# EAGLE design UVC Module (EAGLE 9.4.2)
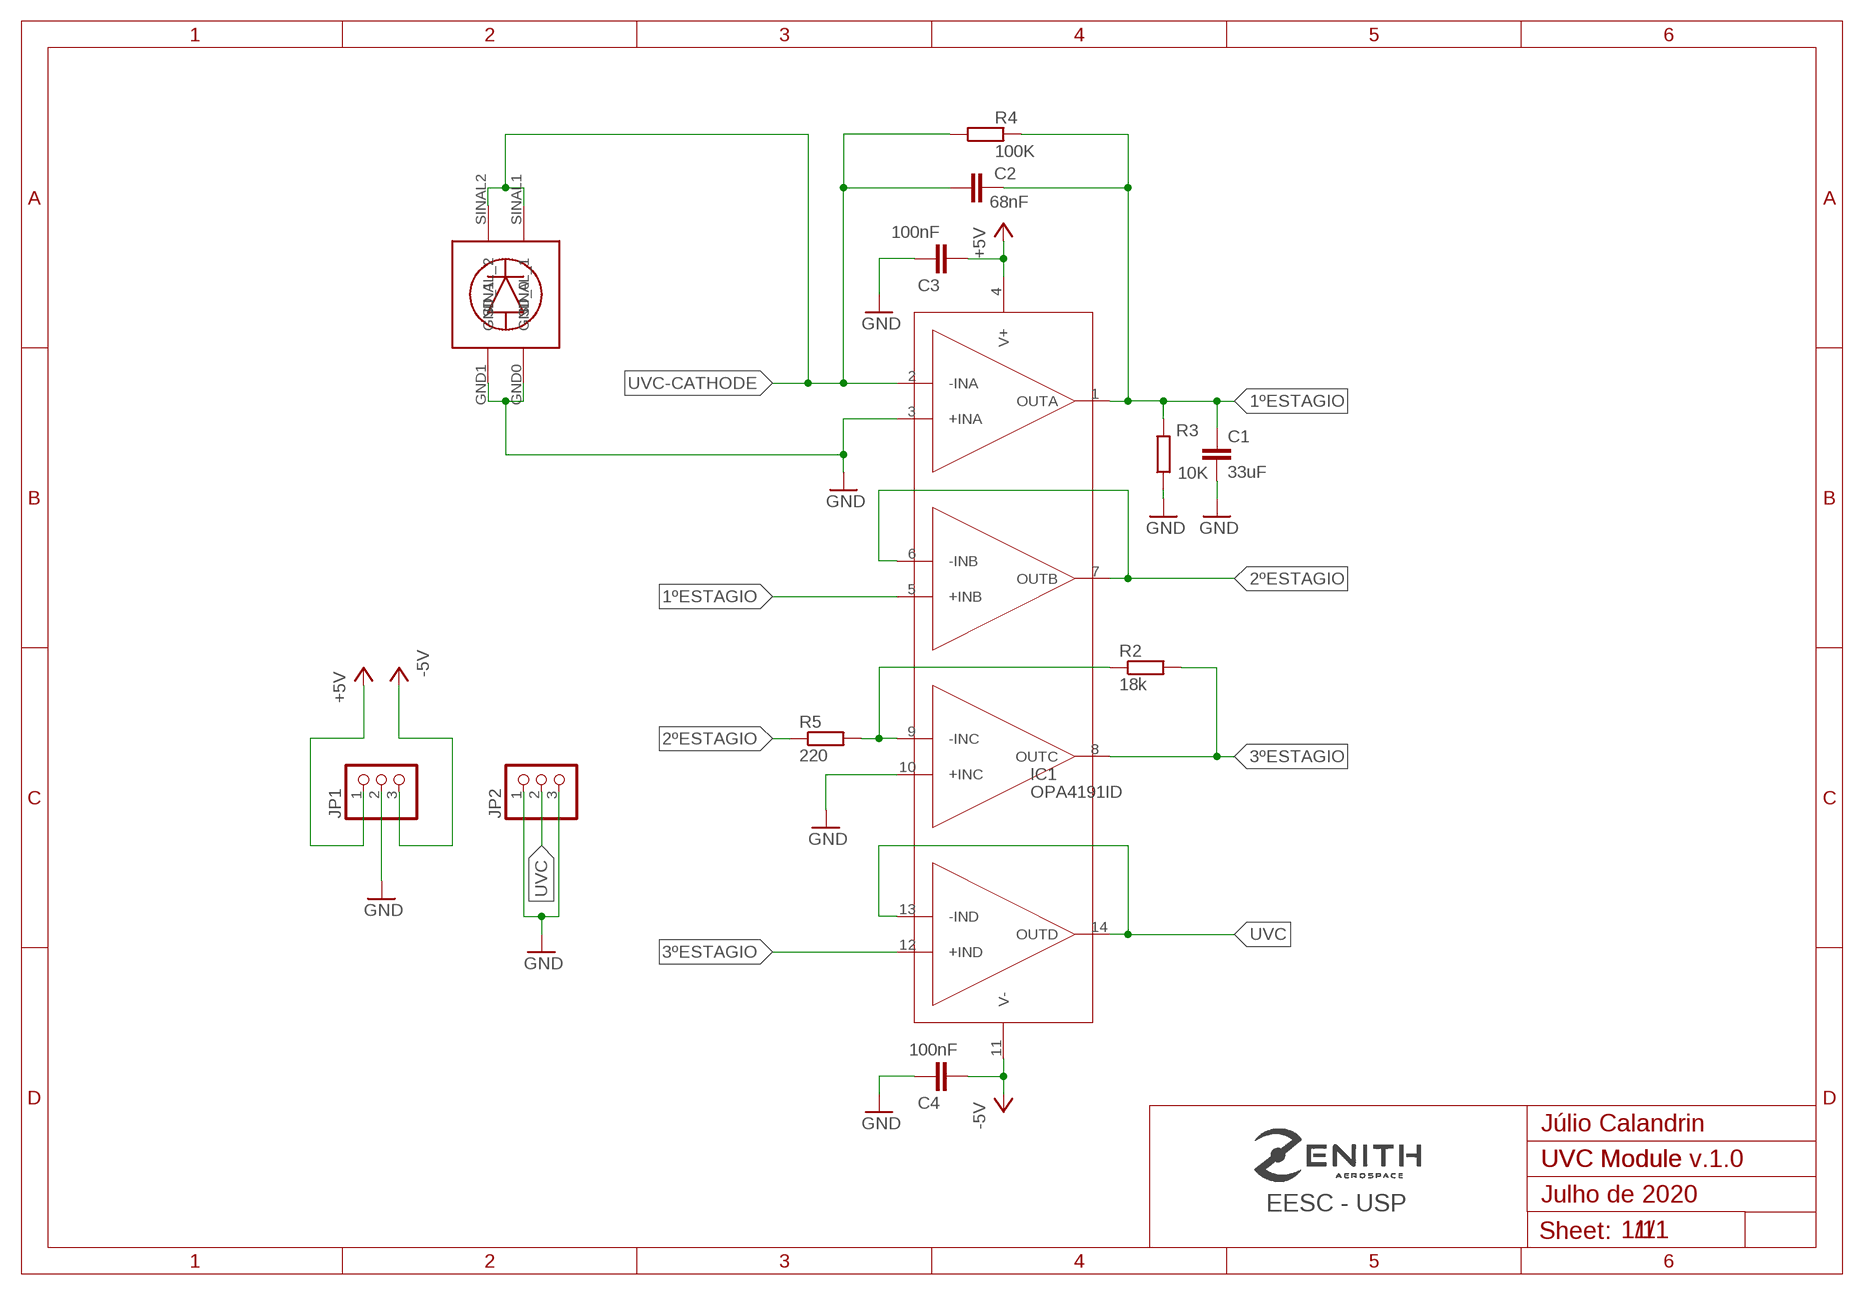
[diagram p0: schematic, sheet 1]

## Parts
C1  33uF  C-EUC0805  [C0805]
C2  68nF  C-EUC0805  [C0805]
C3  100nF  C-EUC0805  [C0805]
C4  100nF  C-EUC0805  [C0805]
IC1  OPA4191ID  [D14_TEX]
JP1  PINHD-1X3  [1X03]
JP2  PINHD-1X3  [1X03]
R2  18k  R-EU_R0805  [R0805]
R3  10K  R-EU_R0805  [R0805]
R4  100K  R-EU_R0805  [R0805]
R5  220  R-EU_R0805  [R0805]
U$1  BREAKOUT_UV-C  [PADS_UV-C]

## Nets
1ºESTAGIO: C1.1 C2.2 IC1.1(OUTA) IC1.5(+INB) R3.2 R4.2
2ºESTAGIO: IC1.6(-INB) IC1.7(OUTB) R5.1
3ºESTAGIO: IC1.8(OUTC) IC1.12(+IND) R2.2
+5V: C3.1 IC1.4(V+) JP1.1
-5V: C4.1 IC1.11(V-) JP1.3
GND: C1.2 C3.2 C4.2 IC1.3(+INA) IC1.10(+INC) JP1.2 JP2.1 JP2.3 R3.1 U$1.GND0(GND_0) U$1.GND1(GND_1)
N$1: IC1.9(-INC) R2.1 R5.2
UVC: IC1.13(-IND) IC1.14(OUTD) JP2.2
UVC-CATHODE: C2.1 IC1.2(-INA) R4.1 U$1.SINAL1(SINAL_1) U$1.SINAL2(SINAL_2)

## Notes on the sheet
- Júlio Calandrin
- UVC Module v.1.0
- EESC - USP | Julho de 2020
- 1/1

## Library data of the parts
C1-C4 = rcl:C-EU: CAPACITOR, European symbol; SPICEPREFIX: C
IC1 = OPA4191:OPA4191ID; BUILT_BY: EMA_Molly; COPYRIGHT: Copyright (C) 2018 Accelerated Designs. All rights reserved; MANUFACTURER_PART_NUMBER: OPA4191ID; SOURCELIBRARY: TI_2019-05-11; VENDOR: Texas Instruments
JP1 JP2 = pinhead(1x3):PINHD-1X3: PIN HEADER
R2-R5 = rcl:R-EU_: RESISTOR, European symbol; SPICEPREFIX: R
U$1 = Zenith_Breakouts:BREAKOUT_UV-C

## Board
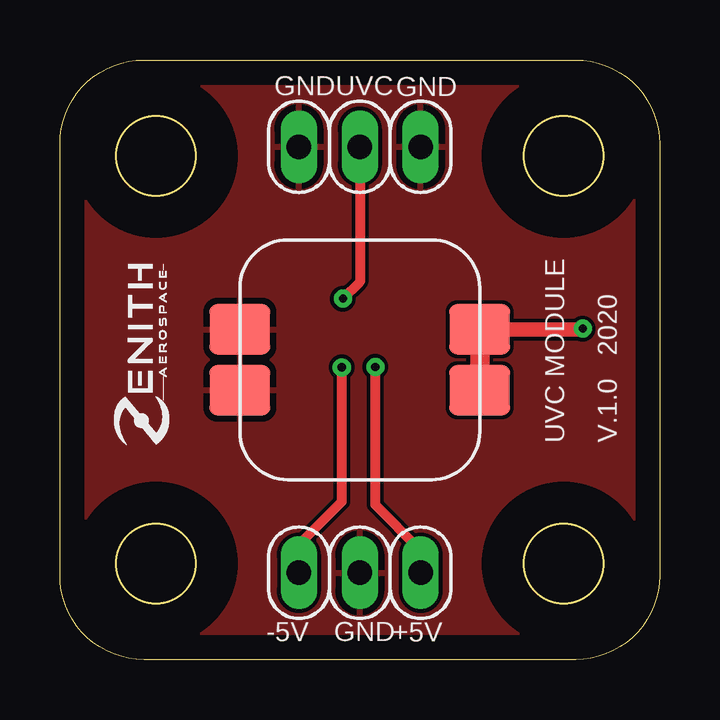
[diagram p1: board, top side]
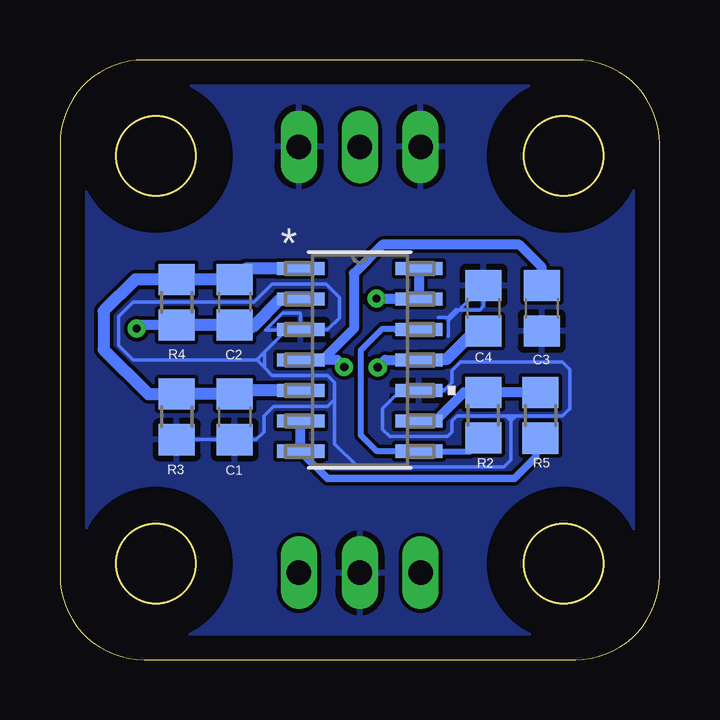
[diagram p2: board, bottom side, seen from below]

Size 25 x 25 mm. Coordinates in mm from the lower left corner, seen from the top.
Outline: 0,3.5 0,21.5 arc-90 3.5,25 21.5,25 arc-90 25,21.5 25,3.5 arc-90 21.5,0 3.5,0 arc-90 0,3.5
Outline: circle at 4,21 radius 1.65
Outline: circle at 21,21 radius 1.65
Outline: circle at 4,4 radius 1.65
Outline: circle at 21,4 radius 1.65
Copper layers (1*16): Top 0.035mm / dielectric 1.5mm / Bottom 0.035mm
Design rules "default": minimum track width 6mil, minimum drill 0.35mm, track to track 6mil, track to pad 6mil, pad to pad 6mil, via to via 6mil, smd to smd 6mil, copper to edge 40mil, drill to drill 6mil, minimum pad ring 10mil, minimum via ring 8mil, stop-mask expansion 4mil, vias tented up to drill 0mil, thermal gap 10mil
tRestrict: area 0.8,17.8 to 7.2,24.2; area 17.8,17.8 to 24.2,24.2; area 0.8,0.8 to 7.2,7.2; area 17.8,0.8 to 24.2,7.2
bRestrict: area 1,18 to 7,24; area 18,18 to 24,24; area 18,1 to 24,7; area 1,1 to 7,7

### Footprints (pad centres in the part's own frame; a part is rotated, then mirrored left to right if it is on the bottom)
C0805 = smd 1.3 x 1.5: 1 -0.95,0; 2 0.95,0
D14_TEX = smd 1.97 x 0.558: 1 -2.464,3.81; 2 -2.464,2.54; 3 -2.464,1.27; 4 -2.464,0; 5 -2.464,-1.27; 6 -2.464,-2.54; 7 -2.464,-3.81; 8 2.464,-3.81; 9 2.464,-2.54; 10 2.464,-1.27; 11 2.464,0; 12 2.464,1.27; 13 2.464,2.54; 14 2.464,3.81
1X03 = drill 1.016 long: 1 -2.54,0; 2 0,0; 3 2.54,0
R0805 = smd 1.3 x 1.5: 1 -0.95,0; 2 0.95,0
PADS_UV-C = smd 2.54 x 2.1: GND0 -5,-1.27; GND1 -5,1.27; SINAL1 5,1.27; SINAL2 5,-1.27

### Placement (x,y rotation side)
C1  17.71,10.12 270 bottom
C2  17.71,14.9 90 bottom
C3  4.91,14.65 270 bottom
C4  7.34,14.64 90 bottom
IC1  12.49,12.49 0 bottom
JP1  12.5,3.62 180 top
JP2  12.5,21.38 180 top
R2  7.35,10.19 270 bottom
R3  20.14,10.12 90 bottom
R4  20.14,14.9 90 bottom
R5  4.96,10.18 90 bottom
U$1  12.5,12.5 0 top

### Tracks (layer width: path | path; a pad name or v marks a point on that pad's centre or on a via)
1ºESTAGIO
  Bottom 0.254: 17.79,11.54 C1.1 | C2.2 17.46,16.15 | IC1.5 14.99,11.25
  Bottom 0.508: IC1.1 17.26,16.3 C2.2 R4.2 21.85,15.85 23.18,14.52 23.18,12.94 21.31,11.07 R3.2 C1.1 17.56,11.22 IC1.5
2ºESTAGIO
  Bottom 0.305: R5.1 5.15,9.04 5.15,8.45 6.05,7.55 13.85,7.55 14.96,8.66
  Bottom 0.406: IC1.6 IC1.7 14.96,8.66
3ºESTAGIO
  Bottom 0.254: R2.2 7.93,8.67 10.02,8.67 | IC1.8 11.78,8.68 12.45,9.35 12.45,12.9 11.55,13.8 10.93,13.8 10.89,13.76
  Bottom 0.406: 10.02,8.67 IC1.8 | 10.89,13.76 IC1.12
+5V  (via drill 0.35)
  Top 0.406: JP1.1 15.04,4.56 13.15,6.45 v13.15,12.2
  Bottom 0.406: C3.1 4.91,16.36 5.85,17.3 11.55,17.3 12.75,16.1 12.75,13.8 14.06,12.49 IC1.4 13.44,12.49 v13.15,12.2
-5V  (via drill 0.35)
  Top 0.406: JP1.3 9.96,4.8 11.75,6.59 v11.75,12.18
  Bottom 0.254: 9.45,12.49 IC1.11
  Bottom 0.406: C4.1 7.5,13.7 | v11.75,12.18 11.44,12.49 IC1.11
  Bottom 0.508: C4.1 7.71,13.7 8.86,12.54 9.98,12.54 IC1.11
GND
  Bottom 0.152: 15.89,13.76 15.6,13.76 15.63,13.73 16.43,13.73 15.72,14.45 15,14.45 14.96,14.41 IC1.3 | 16.8,12.5 16.75,12.5 16.75,12.45 16.48,12.18 | IC1.3 13.84,13.76 13.35,14.25 13.35,15.1 13.9,15.65 16.15,15.65 16.9,14.9 21.95,14.9 22.55,14.3 22.55,13.1 21.95,12.5 21.45,12.5 16.8,12.5 | 13.55,10.85 13.55,11.55 13.85,11.85 16.15,11.85 16.48,12.18 | 13.55,10.85 13.85,10.55 16.1,10.55 16.5,10.15 16.5,9.5 16.83,9.17 C1.2 | C1.2 17.61,9.27 | R3.1 C1.2 | 3.74,10.45 3.74,12.09 4.05,12.4 8.3,12.4 8.65,12.05 8.65,11.55 8.98,11.22 IC1.10 10.79,11.22 11.55,10.46 11.55,9.6 11.25,9.3 8.85,9.3 8.65,9.5 8.65,9.95 8.45,10.15 6.4,10.15 | 3.79,10.4 4.04,10.15 6,10.15 | 6,10.15 6.2,10.15 | 6.2,10.15 6.4,10.15 | IC1.3 15.54,13.76 16.48,12.82 | 16.8,12.5 16.48,12.82 | 16.48,12.82 16.48,12.18 | 13.55,10.85 13.55,9 12.58,8.03 6.5,8.03 6.2,8.33 6.2,9.95 | 6.2,9.95 6.2,10.15 | 6,10.15 6.2,9.95 | 6.2,9.95 6.4,10.15 | 9.22,14.27 8.83,14.27 8.5,14.6 8.47,14.57 7.5,14.57 7.34,14.73 C4.2 8.8,14.14 8.8,13.5 8.82,13.48
  pour Top: -0.5,25.5 25.5,25.5 25.5,-0.5 -0.5,-0.5
  pour Bottom: -0.5,25.5 25.5,25.5 25.5,-0.5 -0.5,-0.5
N$1
  Bottom 0.254: 9.21,9.95 9.35,9.95
  Bottom 0.406: IC1.9 9.35,9.95 8.16,11.14 R2.1 R5.2
UVC  (via drill 0.35)
  Top 0.406: v11.8,15.05 12.5,15.75 12.5,20.5 12.55,20.55 JP2.2
  Bottom 0.406: IC1.14 IC1.13 11.78,15.03 v11.8,15.05
UVC-CATHODE  (via drill 0.35)
  Top 0.61: U$1.SINAL1 21.77,13.77 v21.8,13.8
  Top 0.813: U$1.SINAL2 U$1.SINAL1
  Bottom 0.254: 17.9,13.6 17.78,13.88 C2.1 | R4.1 20.11,13.45
  Bottom 0.406: R4.1 21.65,13.95 v21.8,13.8
  Bottom 0.508: IC1.2 15.82,15.03 17,13.85 17.61,13.85 C2.1 R4.1

### Text on the board
tNames: GND | UVC | GND | UVC MODULE | V.1.0 2020 | -5V | GND | +5V